# Altium schematic sheet Interface.SchDoc
size 381 x 203 mm; SheetNumber: 1; SheetTotal: 1
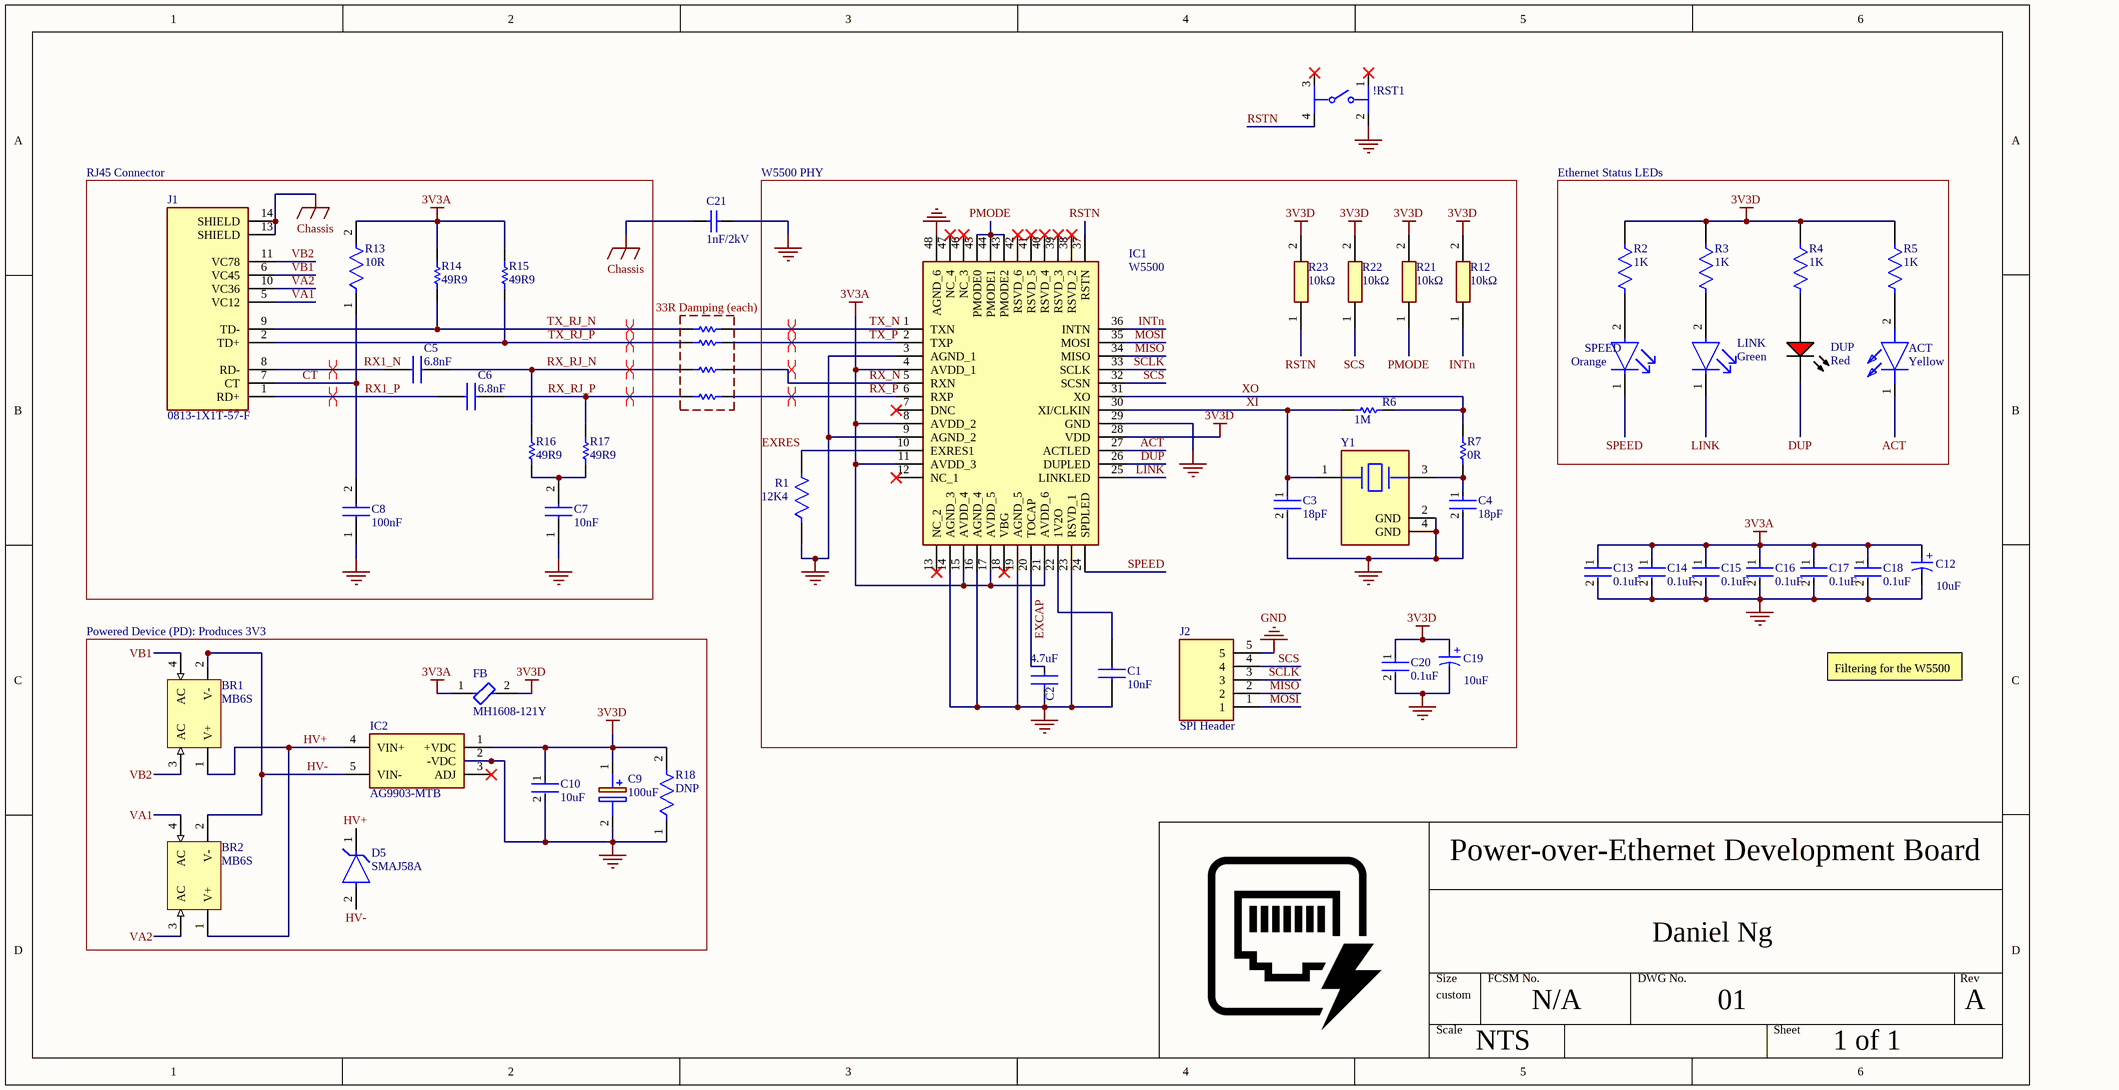
[diagram p0: Interface.SchDoc]

## Parts
!RST1  PTS645SM43SMTR92LFS  [FP-PTS645SM43SMTR92LFS-MFG]  (value not drawn)
ACT  Yellow  [LTSTC171KSKT]
BR1  MB6S  [FAIR-MBXS_V]
BR2  MB6S  [FAIR-MBXS_V]
C1  10nF  [C0603]
C2  4.7uF  [FP-CL10-IPC_C]
C3  18pF  [FP-C0603C-CF-MFG]
C4  18pF  [FP-C0603C-CF-MFG]
C5  6.8nF  [CAPC1608X87N]
C6  6.8nF  [CAPC1608X87N]
C7  10nF  [C0805]
C8  100nF  [CAPC1608X90N]
C9  100uF  [EEHZT1E331UP]
C10  10uF  [FP-GRM188-0_2-IPC_A]
C12  10uF  [WCAP-ASLU_D3H5.5]
C13  0.1uF  [FP-CC0603-DA-MFG]
C14  0.1uF  [FP-CC0603-DA-MFG]
C15  0.1uF  [FP-CC0603-DA-MFG]
C16  0.1uF  [FP-CC0603-DA-MFG]
C17  0.1uF  [FP-CC0603-DA-MFG]
C18  0.1uF  [FP-CC0603-DA-MFG]
C19  10uF  [WCAP-ASLU_D3H5.5]
C20  0.1uF  [FP-CC0603-DA-MFG]
C21  1nF/2kV  [KEMT-1206-2_M]
D5  SMAJ58A  [FP-SMAJ-MFG]
DUP  Red  [LTST-C170KRKT_V]
FB  MH1608-121Y  [FP-MH1608-MFG]
IC1  W5500  [QFP50P900X900X160-48N]
IC2  AG9903-MTB  [AG9903MTB]
J1  0813-1X1T-57-F  [08131X1T57F]
J2  SPI Header  [TSW-105-XX-YY-S]
LINK  Green  [FP-LTST-C170GKT-MFG]
R1  12K4  [FP-RC0603-0_55-MFG]
R2  1K  [FP-RC0603-0_55-IPC_C]
R3  1K  [FP-RC0603-0_55-IPC_C]
R4  1K  [FP-RC0603-0_55-IPC_C]
R5  1K  [FP-RC0603-0_55-IPC_C]
R6  1M  [RESC1608X55X25LL10T15]
R7  0R  [RESC1608X55X25ML10T15]
R8  33R  [RESC2013X60X35LL10T20]  (value not drawn)
R9  33R  [RESC2013X60X35LL10T20]  (value not drawn)
R10  33R  [RESC2013X60X35LL10T20]  (value not drawn)
R11  33R  [RESC2013X60X35LL10T20]  (value not drawn)
R12  10kΩ  [RESC1608X55N]
R13  10R  [FP-RC0603-0_55-IPC_C]
R14  49R9  [RESC1608X55X30ML15T15]
R15  49R9  [RESC1608X55X30ML15T15]
R16  49R9  [RESC1608X55X30ML15T15]
R17  49R9  [RESC1608X55X30ML15T15]
R18  DNP  [FP-AF0805-IPC_C]
R21  10kΩ  [RESC1608X55N]
R22  10kΩ  [RESC1608X55N]
R23  10kΩ  [RESC1608X55N]
SPEED  Orange  [FP-LTST-C170KFKT-MFG]
Y1  ABM8-25.000MHZ-B2-T  [FP-ABM8-MFG]  (value not drawn)

## Blocks framed on the sheet
RJ45 Connector: C5-C8 J1 R13-R17
W5500 PHY: C1-C4 C19 C20 IC1 J2 R1 R6 R7 R12 R21-R23 Y1
Ethernet Status LEDs: ACT DUP LINK R2-R5 SPEED
33R Damping (each): R8-R11
Powered Device (PD): Produces 3V3: BR1 BR2 C9 C10 D5 FB IC2 R18

## Nets
3V3A: C12.1(P) C13.1 C14.1 C15.1 C16.1 C17.1 C18.1 FB.1 IC1.4(AVDD_1) IC1.8(AVDD_2) IC1.11(AVDD_3) IC1.15(AVDD_4) IC1.17(AVDD_5) IC1.21(AVDD_6) R13.2 R14.2 R15.2
3V3D: C9.1(+) C10.1 C19.1(P) C20.1 FB.2 IC1.28(VDD) IC2.1(+VDC) R2.1 R3.1 R4.1 R5.1 R12.2 R18.2 R21.2 R22.2 R23.2
Chassis: C21.1 J1.13(SHIELD) J1.14(SHIELD)
GND: !RST1.2 C1.1 C2.1 C3.2 C4.2 C7.1 C8.1 C9.2(-) C10.2 C12.2(N) C13.2 C14.2 C15.2 C16.2 C17.2 C18.2 C19.2(N) C20.2 C21.2 IC1.3(AGND_1) IC1.9(AGND_2) IC1.14(AGND_3) IC1.16(AGND_4) IC1.19(AGND_5) IC1.23(RSVD_1) IC1.29(GND) IC1.48(AGND_6) IC2.2(-VDC) J2.5 R1.1 R18.1 Y1.2(GND) Y1.4(GND)
ACT: ACT.1(K) IC1.27(ACTLED)
CT: C8.2 J1.7(CT) R13.1
DUP: DUP.2(K) IC1.26(DUPLED)
EXCAP: C2.2 IC1.20(TOCAP)
EXRES: IC1.10(EXRES1) R1.2
HV+: BR1.1(V+) BR2.1(V+) D5.1(C) IC2.4(VIN+)
HV-: BR1.2(V-) BR2.2(V-) D5.2(A) IC2.5(VIN-)
INTn: IC1.36(INTN) R12.1
LINK: IC1.25(LINKLED) LINK.1(C)
MISO: IC1.34(MISO) J2.2
MOSI: IC1.35(MOSI) J2.1
PMODE: IC1.43(PMODE2) IC1.44(PMODE1) IC1.45(PMODE0) R21.1
RSTN: !RST1.4 IC1.37(RSTN) R23.1
RX1_N: C5.1 J1.8(RD-)
RX1_P: C6.1 J1.1(RD+)
RX_N: IC1.5(RXN) R10.2
RX_P: IC1.6(RXP) R11.2
RX_RJ_N: C5.2 R10.1 R16.2
RX_RJ_P: C6.2 R11.1 R17.2
SCLK: IC1.33(SCLK) J2.3
SCS: IC1.32(SCSN) J2.4 R22.1
SPEED: IC1.24(SPDLED) SPEED.1(C)
TX_N: IC1.1(TXN) R8.2
TX_P: IC1.2(TXP) R9.2
TX_RJ_N: J1.9(TD-) R8.1 R14.1
TX_RJ_P: J1.2(TD+) R9.1 R15.1
VA1: BR2.4(AC) J1.5(VC12)
VA2: BR2.3(AC) J1.10(VC36)
VB1: BR1.4(AC) J1.6(VC45)
VB2: BR1.3(AC) J1.11(VC78)
XI: C3.1 IC1.30(XI/CLKIN) R6.1 Y1.1
XO: IC1.31(XO) R6.2 R7.2
NetACT_2: ACT.2(A) R5.2
NetC1_2: C1.2 IC1.22(1V2O)
NetC4_1: C4.1 R7.1 Y1.3
NetC7_2: C7.2 R16.1 R17.1
NetDUP_1: DUP.1(A) R4.2
NetLINK_2: LINK.2(A) R3.2
NetR2_2: R2.2 SPEED.2(A)

Not connected (* = marked no-connect by the designer): !RST1 1* 3*; IC1 7(DNC)* 12(NC_1)* 13(NC_2)* 18(VBG)* 38(RSVD_2)* 39(RSVD_3)* 40(RSVD_4)* 41(RSVD_5)* 42(RSVD_6)* 46(NC_3)* 47(NC_4)*; IC2 3(ADJ)*

## Layout directives
differential pair: RX1_N, RX1_P, RX_N, RX_P, RX_RJ_N, RX_RJ_P, TX_N, TX_P, TX_RJ_N, TX_RJ_P

## Notes on the sheet
- Filtering for the W5500
- Power-over-Ethernet Development Board
- Daniel Ng
- N/A
- 01
- A
- NTS
- 1 of 1
- (in symbol CMP-207834-000002-3) +

## Library data of the parts
!RST1 = CMP-2000-05160-2: SWITCH TACTILE SPST-NO 0.05A 12V; Contact Resistance: 100mR; Throw Configuration: SPST; Illumination Type: Non-Illuminated; Mechanical Life: 100000Cycles; Current Rating: 50mA; Switch Function: Off-Mom; Actuator Length: 0.85mm; Actuator Material: Nylon; Actuator Type: Standard; Operating Force: 160gf; Min Operating Temperature: -20°C; REACH SVHC: No SVHC; Termination: Gull Wing; Case/Package: SMD/SMT; Packaging: Tape and Reel; Mount: Surface Mount; Voltage Rating (DC): 12V; Orientation: Straight; Lead Free: Lead Free; Contact Material: Silver; Color: Black; Max Current Rating: 50mA; Contact Plating: Silver; Depth: 9mm; Package Quantity: 1; Max Voltage Rating (DC): 12V; Length: 6mm; Max Operating Temperature: 60°C
ACT = LTST-C171KSKT: LED; Manufacturer_Name: Lite-On; Datasheet Link: https://optoelectronics.liteon.com/upload/download/DS22-2000-110/LTST-C171KSKT.pdf; Height: 0.9mm; Manufacturer_Part_Number: LTST-C171KSKT; Mouser Part Number: 859-LTST-C171KSKT; Mouser Price/Stock: https://www.mouser.co.uk/ProductDetail/LITEON/LTST-C171KSKT?qs=llMtm9xcdM0CwR1bByTaUQ%3D%3D; Arrow Part Number: LTST-C171KSKT; Arrow Price/Stock: https://www.arrow.com/en/products/ltst-c171kskt/lite-on-technology.html?utm_currency=USD&region=nac
BR1 BR2 = CMP-2000-06669-1: Bridge Rectifier, 0.5 A, -55 to 150 degC, 4-Pin SMD, RoHS, Tape and Reel; Manufacturer: FairchildSemiconductor; Peak Average Forward Current: 0.5@Ta=50CA; Peak Reverse Repetitive Voltage: 600V; Peak Reverse Current: 5uA; Peak Forward Voltage: 1V; Bridge Type: SinglePhase; Configuration: Single; Rad Hard: No; Manufacturer URL: https://www.fairchildsemi.com/; Category: BridgeRectifier; Packaging: Tape&Reel; Operating Temperature: -55to150°C; Package Description: 4-Pin Surface Mount Device, Body 4.725 x 3.9 mm, Pitch 2.54 mm; Package Reference: MBXS; Datasheet URL: http://www.fairchildsemi.com/datasheets/MB/MB1S.pdf; Mounting: SurfaceMount; Datasheet Version: Rev. 1.2.3, 04/2014; Mounting Technology: SurfaceMount; Package: 4SOICN
C1 = C0603C103K4RECTU: Capacitor; Manufacturer_Name: Yageo Group; Datasheet Link: https://content.kemet.com/datasheets/KEM_C1090_X7R_ESD.pdf; Height: 0.87mm; Manufacturer_Part_Number: C0603C103K4RECTU; Mouser Part Number: 80-C0603C103K4RECTU; Mouser Price/Stock: https://www.mouser.co.uk/ProductDetail/KEMET/C0603C103K4RECTU?qs=55YtniHzbhDzGaFFpCm8vg%3D%3D; Arrow Part Number: C0603C103K4RECTU; Arrow Price/Stock: https://www.arrow.com/en/products/c0603c103k4rectu/kemet-corporation?region=nac
C2 = CMP-13271-003017-1: Cap Ceramic 4.7uF 10V X5R ±10% Pad SMD 0603 +85°C T/R; Capacitance: 4.7uF; Case/Package: 0603; Packaging: Tape and Reel; Width: 0.031inch; Contact Plating: Tin; Thickness: 0.035inch; Package Quantity: 1; Voltage Rating: 10V; Case Code (Metric): 1608; Case Code (Imperial): 0603; Depth: 0.8mm; Height: 0.8mm; Tolerance: 10%; Max Operating Temperature: 85°C; Length: 1.6mm; Dielectric: X5R; Mount: Surface Mount; Radiation Hardening: No; Min Operating Temperature: -55°C
C3 C4 = CMP-2006-03702-3: CAP CER 18PF 50V C0G/NP0 0603; Manufacturer Part Number: C0603C180J5GACTU; Manufacturer: KEMET; Automotive Grade: Grade 1; Tolerance: 0.05; Temperature Coefficient: 30ppm/°C; Temperature Characteristic: C0G; Material: Ceramic; ComponentLink2URL: https://api.kemet.com/component-edge/download/datasheet/C0603C100J5GACAUTO.pdf; Value: 18 pF; Capacitance: 18 pF; Device Class L3: Ceramic Capacitors; Digikey Description: CAP CER 18PF 50V C0G/NP0 0603; RoHS: TRUE; Category: Cap; Temperature Range Low: -55°C; Lead Free: Yes; Device Class L1: Passive Components; Device Class L2: Capacitors; Package: C0603C-CF; Mouser Description: Capacitor; Ceramic; Cap; 18.0pF; Tol 5%; SMT; Vol-Rtg 50V; C0G; Tape and Reel; Temperature Range High: +125°C; Temperature: -55°C to +125°C; Octopart: https://octopart.com/c0603c180j5gactu-kemet-97992; ComponentLink2Description: Datasheet; Automotive: Yes; Voltage Rating: 50 V; Height: 0.87mm
C5 C6 = C0603C682K4REC7411: Capacitor; Manufacturer_Name: Yageo Group; Datasheet Link: https://www.yageogroup.com/content/datasheet/asset/file/KEM_C1090_X7R_ESD; Height: 0.87mm; Manufacturer_Part_Number: C0603C682K4REC7411
C7 = C0805C103K5RECAUTO: Capacitor; Manufacturer_Name: Yageo Group; Datasheet Link: https://www.yageogroup.com/content/datasheet/asset/file/KEM_C1090_X7R_ESD; Height: 1.1mm; Manufacturer_Part_Number: C0805C103K5RECAUTO
C8 = CL10E104KC8VPNC: Capacitor; Manufacturer_Name: SAMSUNG; Datasheet Link: https://product.samsungsem.com/mlcc/CL10E104KC8VPN.do; Height: 0.9mm; Manufacturer_Part_Number: CL10E104KC8VPNC; Mouser Part Number: 187-CL10E104KC8VPNC; Mouser Price/Stock: https://www.mouser.co.uk/ProductDetail/Samsung-Electro-Mechanics/CL10E104KC8VPNC?qs=Imq1NPwxi75HCIKjcbKf0w%3D%3D; Arrow Part Number: CL10E104KC8VPNC; Arrow Price/Stock: https://www.arrow.com/en/products/cl10e104kc8vpnc/samsung-electro-mechanics?utm_currency=USD&region=nac
C9 = EEE-FP1V101AP: Capacitor Polarised; Manufacturer_Name: Panasonic; Datasheet Link: http://industrial.panasonic.com/cdbs/www-data/pdf/RDE0000/ABA0000C1184.pdf; Height: 10.8mm; Manufacturer_Part_Number: EEE-FP1V101AP; Mouser Part Number: 667-EEE-FP1V101AP; Mouser Price/Stock: https://www.mouser.co.uk/ProductDetail/Panasonic/EEE-FP1V101AP?qs=d1CqaRUMZD%252BedtcvZLkG3A%3D%3D; Arrow Part Number: EEE-FP1V101AP; Arrow Price/Stock: https://www.arrow.com/en/products/eee-fp1v101ap/panasonic?region=europe
C10 = CMP-06035-045268-1: Chip Multilayer Ceramic Capacitors for General Purpose, 0603, 10uF, X5R, 15%, 10%, 25V; Case/Package: 0603
C12 C19 = CMP-207834-000002-3: Cap WCAP-ASLU Aluminum Electrolytic 10uF; Dissipation Factor: 18%; Tolerance: 20%; Capacitance: 10µF; Voltage Rating: 16V; Leakage Current: 3µA; Ripple Current: 20mA; Life (Hours): 2000hours; Max Operating Temperature: 85°C; Diameter: 3mm; RoHS: Compliant; Height: 5.5mm; Min Operating Temperature: -40°C; Width: 3.3mm; Voltage Rating (DC): 16V; Case/Package: Radial; Length: 5.5mm
C13-C18 C20 = CMP-2100-03601-2: CAP CER 0.1UF 50V X7R 0603; Manufacturer: YAGEO; Manufacturer Part Number: CC0603KRX7R9BB104; Material: Ceramic; Capacitance: 100 nF; Temperature Coefficient: 15%; Tolerance: 0.1; Value: 100 nF; Height: 0.9mm; Voltage: 50 V; ComponentLink2Description: Datasheet; Device Class L2: Capacitors; Temperature Range High: +125°C; Category: Cap; Footprint Url: http://www.yageo.com/exep/pages/download/literatures/UPY-C_GEN_24.pdf; ComponentLink2URL: http://www.yageo.com/documents/recent/UPY-GPHC_X7R_6.3V-to-50V_18.pdf; Package: CC0603-DA; Temperature: -55°C to +125°C; Voltage Rating: 50 V; Temperature Characteristic: X7R; Device Class L1: Passive Components; Temperature Range Low: -55°C; RoHS: TRUE; Automotive: No; Device Class L3: Ceramic Capacitors; Octopart: https://octopart.com/cc0603krx7r9bb104-yageo-42244635; Mouser Description: Multilayer Ceramic Capacitor, CC Series, 0.1 - F, - 10%, X7R, 50 V, 0603 [1608 Metric]; Lead Free: Yes; Digikey Description: CAP CER 0.1UF 50V X7R 0603
C21 = CMP-1037-04202-2: CAP, Ceramic, 0.1 uF, +/- 10%, 50 V, -55 to 125 degC, 1206 (3216 Metric), RoHS, Tape and Reel; Manufacturer: Kemet; Voltage Rating: 50V; Capacitance: 0.1µF; Product Range: KEMET-CSeries; SVHC: ToBeAdvised; Dielectric Characteristic: X7R; Capacitor Case Style: 1206[3216Metric]; Package Reference: 1206-2; Package Description: 2-Leads SMD, Body 3.2 x 1.6 mm; Packaging: Tape&Reel; Operating Temperature Max: 125degC; Capacitance Tolerance: ±10%; Datasheet URL: https://datasheet.ciiva.com/6125/1725438-6125494.pdf; Manufacturer URL: http://www.kemet.com/; Operating Temperature Min: -55degC; Datasheet Version: Jul-13
D5 = CMP-08607-000100-1: TVS DIODE 58V 93.6V DO214AC; Test Current: 1mA; Max Reverse Leakage Current: 1uA; Power Dissipation: 400W; Reverse Breakdown Voltage: 64.4V; Direction: Unidirectional; Current: 43A; Number of Unidirectional Channels: 1; Power Line Protection: No; Peak Pulse Current: 4.3A; Max Breakdown Voltage: 71.2V; Max Power Dissipation: 3.3W; Element Configuration: Single; Max Operating Temperature: 150°C; Length: 4.5mm; Composition: Zener; Min Operating Temperature: -65°C; Voltage: 58V; Clamping Voltage: 93.6V; Breakdown Voltage: 64.4V; Operating Supply Voltage: 58V; Lead Free: Lead Free; Leakage Current: 1uA; Reverse Standoff Voltage: 58V; Packaging: Tape and Reel; Min Breakdown Voltage: 64.4V; Termination: SMD/SMT; Mount: Surface Mount; Width: 2.79mm; Package Quantity: 5000; Polarity: Unidirectional; Number of Channels: 1; Number of Elements: 1; Number of Pins: 2; REACH SVHC: No SVHC; Height: 2.087mm; Peak Pulse Power: 400W; Voltage Rating (DC): 58V; Max Surge Current: 4.3A
DUP = CMP-2000-07593-1: LED Red, 75 mW, 54 mcd, -55 to 85 degC, 2-Pin SMD, RoHS, Tape and Reel; Manufacturer: Lite-On; Lens Transparency: Clear; Number of Elements: 1; Power Rating: 75mW; Luminous Intensity: 54mcd; Viewing Angle: 130degrees; Forward Current: 30mA; Wavelength: 639nm; Lens Style: Rectangular; Case\/Package: 0805; Test Current: 20mA; Dominant Wavelength: 631nm; Forward Voltage: 2V; Lens Colour: Colorless; Min Operating Temperature: -55degC; RoHSCompliant: True; Length: 3.2mm; Width: 1.25mm; Mount: SurfaceMount; Packaging: TapeandReel; Number of LEDs: 1; Radiation Hardening: No; Datasheet URL: http://optoelectronics.liteon.com/upload/download/DS-22-99-0150/LTST-C170KRKT.pdf; Datasheet Version: Rev. D, 11/2014; Case Code (Metric): 2012; Height: 1.1mm; Number of Pins: 2; Package Description: 2-Pin Surface Mount Device, Body 2 x 1.25 mm; Manufacturer URL: http://www.us.liteon.com/; Lead Free: LeadFree; Illumination Colour: Red; Colour: Red; Case Code (Imperial): 0805; Max Operating Temperature: 85degC; Power Dissipation: 75mW; Mounting Technology: SurfaceMount; Package Reference: C170KRKT; Package Quantity: 1; Depth: 1.6mm
FB = CMP-00059-02110036-1: MH1608-121Y Ferrite Beads High Current Chip 120Ohm 25% 100MHz 2A 100mOhm DCR 0603 T/R; Series Resistance: 100mΩ; Number of Lines: 1; Impedance: 120Ω; Case Code (Metric): 1608; Case/Package: 0603; Core Material: Ferrite; Termination: SMD/SMT; Case Code (Imperial): 0603; Max DC Current: 2A; Test Frequency: 100MHz; REACH SVHC: No SVHC; Packaging: Tape & Reel (TR); Max Operating Temperature: 125°C; Height: 990.6µm; Depth: 1mm; Schedule B: 8504500000, 8504500000; Tolerance: 25%; RoHS: Compliant; Current Rating: 2A; Min Operating Temperature: -55°C; NexarPartId: 2110036; Mount: Surface Mount; Length: 1.6002mm; Max Current Rating: 2A; DC Resistance (DCR): 100mΩ; Resistance: 100mΩ; RMS Current (Irms): 2A; Width: 787.4µm
IC1 = W5500: Integrated Circuit; Manufacturer_Name: Wiznet Technology; Datasheet Link: https://docs.wiznet.io/img/products/w5500/W5500_ds_v110e.pdf; Height: 1.6mm; Manufacturer_Part_Number: W5500; Arrow Part Number: W5500; Arrow Price/Stock: https://www.arrow.com/en/products/w5500/wiznet?utm_currency=USD&region=nac
IC2 = AG9903-MTB: Integrated Circuit; Manufacturer_Name: Silvertel; Datasheet Link: https://silvertel.com/images/datasheets/Ag9900M-datasheet-ultra-miniature-isolated-Power-over-Ethernet-POE-module.pdf; Height: 13.9mm; Manufacturer_Part_Number: AG9903-MTB; Mouser Part Number: 480-AG9903-MTB; Mouser Price/Stock: https://www.mouser.co.uk/ProductDetail/Silvertel/AG9903-MTB?qs=vvQtp7zwQdMW5QJXChJipQ%3D%3D
J1 = 0813-1X1T-57-F: Connector; Manufacturer_Name: BelFuse; Datasheet Link: https://www.belfuse.com/resources/drawings/magneticsolutions/dr-mag-0813-1x1t-57-f.pdf; Height: 15.58mm; Manufacturer_Part_Number: 0813-1X1T-57-F; Mouser Part Number: 530-0813-1X1T-57-F; Arrow Part Number: 0813-1X1T-57-F; Arrow Price/Stock: https://www.arrow.com/en/products/0813-1x1t-57-f/bel-group
J2 = TSW-105-07-F-S: Connector; Manufacturer_Name: SAMTEC; Datasheet Link: http://suddendocs.samtec.com/prints/tsw-xxx-xx-xxx-x-xx-xxx-mkt.pdf; Manufacturer_Part_Number: TSW-105-07-F-S; Mouser Part Number: 200-TSW10507FS; Mouser Price/Stock: https://www.mouser.co.uk/ProductDetail/Samtec/TSW-105-07-F-S?qs=rU5fayqh%252BE0rjSr2FD4jkw%3D%3D; Arrow Part Number: TSW-105-07-F-S; Arrow Price/Stock: https://www.arrow.com/en/products/tsw-105-07-f-s/samtec?region=europe
LINK = CMP-1674-00002-6: LED GREEN CLEAR SMD; Dominant Wavelength: 569nm; Lens Style: Diffused; Forward Voltage: 2.1V; Number of Elements: 1; Wavelength: 565nm; Luminous Intensity: 6mcd; Test Current: 10mA; Power Dissipation: 100mW; Reverse Voltage: 5V; Forward Current: 30mA; Viewing Angle: 130°; Lens Color: Colorless; Min Operating Temperature: -55°C; Number of Pins: 2; Max Operating Temperature: 85°C; Color: Green; Radiation Hardening: No; Illumination Color: Green; Case Code (Metric): 2012; Lens Transparency: Clear; Case/Package: 0805; Width: 1.25mm; Case Code (Imperial): 0805; Package Quantity: 1; Height: 1.1mm; Depth: 1.25mm; Length: 2mm; Power Rating: 100mW; Lead Free: Lead Free; Number of LEDs: 1; Packaging: Tape and Reel; Mount: Surface Mount; Voltage: 5V
R1 = CMP-03412-037814-1: RES SMD 12.4K OHM 1% 1/10W 0603; Temperature Coefficient: 100ppm/°C; Max Power Dissipation: 100mW; Voltage Rating: 50V; Resistance: 12.4kR; Working Voltage: 75V; Tolerance: 1%; Number of Terminations: 2; Width: 0.031inch; RoHS Compliant: Yes; Height: 0.022inch; Case/Package: 0603; Lead Free: Lead Free; Technology: THICK FILM; Resistor Type: Thick Film; Power Rating: 100mW; Case Code (Metric): 1608; Military Standard: Not; Length: 0.063inch; Packaging: Tape and Reel; Features: Moisture Resistant; Construction: Rectangular; Min Operating Temperature: -55°C; Termination: SMD/SMT; Case Code (Imperial): 0603; Voltage Rating (DC): 50V; Depth: 0.8mm; Max Operating Temperature: 155°C; Package Quantity: 1; Series: RC
R2-R5 = CMP-1659-00009-5: RES 1K OHM 1% 1/10W 0603; Resistance: 1kR; Voltage Rating: 50V; Power Rating: 100mW; Temperature Coefficient: 100ppm/°C; Military Standard: Not; REACH SVHC: No SVHC; Size Code: 0603; Features: Moisture Resistant; Number of Terminations: 2; Technology: THICK FILM; Series: RC; Case Code (Metric): 1608; Resistance Tolerance: 1%; Resistor Type: Thick Film; Termination: SMD/SMT; Contact Plating: Tin; Radiation Hardening: No; Min Operating Temperature: -55°C; Max Operating Temperature: 155°C; Packaging: Tape and Reel; Max Power Dissipation: 100mW; RoHS Compliant: Yes; Height: 0.45mm; Lead Free: Lead Free; Case/Package: 0603; Length: 1.6mm; Tolerance: 1%; Case Code (Imperial): 0603; Construction: Rectangular; Depth: 0.8mm
R6 = CMP-1659-00056-1: Chip Resistor, 1 MOhm, +/- 1%, 100 mW, -55 to 155 degC, 0603 (1608 Metric), RoHS, Tape and Reel; Voltage Rating (DC): 25 V; Tolerance: 20%; Case\Package: Radial; Capacitance: 1 mF; Min Operating Temperature: -40 degC; PackageDescription: 2-Pin Surface Mount Device, Body 1.6 x 0.8 mm; ComponentLink1Description: Manufacturer URL; Radiation Hardening: No; DatasheetVersion: Rev. 4, 02/2016; REACH SVHC: No SVHC; Length: 20 mm; Max Operating Temperature: 85 degC; Diameter: 10 mm; Packaging: Bulk; Package Quantity: 200; PackageReference: 0603; Mount: Through Hole; ComponentLink1URL: http://www.yageo.com/; ComponentLink2URL: http://www.yageo.com/documents/recent/PYu-RC_Group_51_RoHS_L_04.pdf; ComponentLink2Description: Datasheet; Width: 0 inch; Lead Pitch: 5 mm; RoHSCompliant: true; Voltage Rating: 25 V; Height: 20 mm
R7 = CMP-2100-03667-1: Chip Resistor, 0 Ohm, +/- 5%, 0.1 W, -55 to 155 degC, 0603 (1608 Metric), RoHS, Tape and Reel; Manufacturer: Yageo; Temperature Coefficient: 200ppm/degreesC; Voltage Rating: 50V; Power Rating: 100mW; Resistance: 0mOhm; Width: 0.8mm; Max Operating Temperature: 155degC; Tolerance: 5%; Package Reference: 0603; Height: 0.45mm; Depth: 0.8mm; Package Description: 2-Pin Surface Mount Device, Body 1.6 x 0.8 mm; Termination: SMD/SMT; Package Quantity: 5000; Case/Package: 0603; Case Code (Imperial): 0603; Radiation Hardening: No; Number of Pins: 2; Length: 1.6mm; Lead Free: LeadFree; Voltage Rating (DC): 50V; Military Standard: Not; Datasheet URL: http://www.yageo.com/NewPortal/yageodocoutput?fileName=/pdf/R-Chip/PYu-RC_Group_51_RoHS_L_5.pdf; Manufacturer URL: http://www.yageo.com/; Packaging: TapeandReel; Case Code (Metric): 1608; Min Operating Temperature: -55degC; Composition: ThickFilm; RoHSCompliant: true; Contact Plating: Tin; Datasheet Version: Rev. 5, 10/2016; REACH SVHC: NoSVHC
R8-R11 = CMP-1659-00015-4: Chip Resistor, 33 Ohm, +/- 1%, 0.125 W, -55 to 155 degC, 0805 (2012 Metric), RoHS, Tape and Reel; Manufacturer: Yageo; Voltage Rating: 150 V; Max Operating Temperature: 155 degC; DatasheetVersion: Rev. 4, 02/2016; RoHSCompliant: true; ComponentLink2Description: Datasheet; PackageDescription: 2-Pin Surface Mounted Device, Body 2 x 1.25 mm; Package Quantity: 5000; Packaging: Tape and Reel; Min Operating Temperature: -55 degC; Mount: Surface Mount; REACH SVHC: No SVHC; ComponentLink1Description: Manufacturer URL; ComponentLink1URL: http://www.yageo.com/; Pins: 2; Mounting Technology: Surface Mount; Height: 0.5 mm; ComponentLink2URL: http://www.yageo.com/documents/recent/PYu-RC_Group_51_RoHS_L_04.pdf; PackageReference: 0805; Length: 2 mm
R12 R21-R23 = RC0603FR0710KL: Resistor; Manufacturer_Name: KEMET; Datasheet Link: http://www.yageo.com/documents/recent/PYu-RC0603_51_RoHS_L_v5.pdf; Height: 0.55mm; Manufacturer_Part_Number: RC0603FR0710KL; Arrow Part Number: RC0603FR0710KL; Arrow Price/Stock: https://www.arrow.com/en/products/rc0603fr-0710kl/yageo
R13 = CMP-2100-03664-2: RES 10K OHM 1% 1/10W 0603; Voltage Rating: 75V; Voltage Rating (DC): 50V; Resistance: 10kR; Power Rating: 100mW; Temperature Coefficient: 100ppm/°C; Depth: 0.8mm; Termination: SMD/SMT; Resistor Type: Thick Film; Series: RC; Construction: Rectangular; Features: Moisture Resistant; Packaging: Tape and Reel; Min Operating Temperature: -55°C; Number of Terminations: 2; Lead Pitch: 0.3mm; RoHS Compliant: Yes; Case/Package: 0603; Resistance Tolerance: 1%; Military Standard: Not; Weight: 7.1E-05oz; Number of Pins: 2; Tolerance: 1%; Length: 1.6mm; Case Code (Imperial): 0603; Lead Free: Lead Free; Width: 0.8mm; Max Power Dissipation: 100mW; Height: 0.45mm; Max Operating Temperature: 155°C; Case Code (Metric): 1608; Size Code: 0603
R14-R17 = CMP-2000-00538-1: Manufacturer: Panasonic; Part Number: ERJ-3EKF49R9V
R18 = CMP-03412-045127-1: Anti-Sulfurated Chip Resistor Automotive Grade 130Ω 1% 0.125W ±100ppm/°C 0805; Resistance: 130R; Max Power Dissipation: 125mW; Width: 0.049inch; Length: 0.079inch; Number of Terminations: 2; Max Operating Temperature: 155°C; Min Operating Temperature: -55°C; RoHS Compliant: Yes; Features: Moisture Resistant; Tolerance: 1%; Resistor Type: Thick Film; Height: 0.024inch; Case/Package: 0805; Packaging: Tape and Reel; Series: AF; Temperature Coefficient: 100ppm/°C
SPEED = CMP-22017-000036-1: LED ORANGE CLEAR SMD; Forward Current: 30mA; Reverse Voltage: 5V; Forward Voltage: 2V; Lens Style: Diffused; Number of Elements: 1; Test Current: 20mA; Lens Color: Colorless; Viewing Angle: 130°; Dominant Wavelength: 605nm; Luminous Intensity: 60mcd; Power Rating: 75mW; Wavelength: 611nm; Min Operating Temperature: -55°C; Packaging: Tape and Reel; Case Code (Metric): 2012; Depth: 1.6mm; Case Code (Imperial): 0805; Mount: Surface Mount; Radiation Hardening: No; Lens Transparency: Clear; Color: Orange; Package Quantity: 1; Illumination Color: Orange; Lead Free: Lead Free; Number of LEDs: 1; Length: 3.2mm; Height: 1.1mm; Number of Pins: 2; Width: 1.25mm; Case/Package: 0805; Power Dissipation: 75mW; Max Operating Temperature: 85°C
Y1 = CMP-27762-013668-1: Crystal 25MHz ±20ppm 18pF SMD-4 3.2mm x 2.5mm; ESR (Equivalent Series Resistance): 50R; Frequency Stability: 50ppm; Max Operating Temperature: 70°C; Operating Frequency: 25 MHz; Mount: Surface Mount; Case/Package: CSMD; Termination: SMD/SMT; Frequency: 25MHz; Frequency Tolerance: 20ppm; Load Capacitance: 18pF; Height: 0.031inch; Lead Free: Lead Free; Min Operating Temperature: -20°C; Depth: 2.5mm; Length: 3.2mm; Resistor Type: Ceramic; Series Resistance: 50R; Radiation Hardening: No; Series: ABM8; Width: 0.098inch; Number of Pins: 4; Package Quantity: 1000; Tolerance: 20ppm; Packaging: Tape and Reel; REACH SVHC: No SVHC